# Altium project PCB_Project.PrjPcb
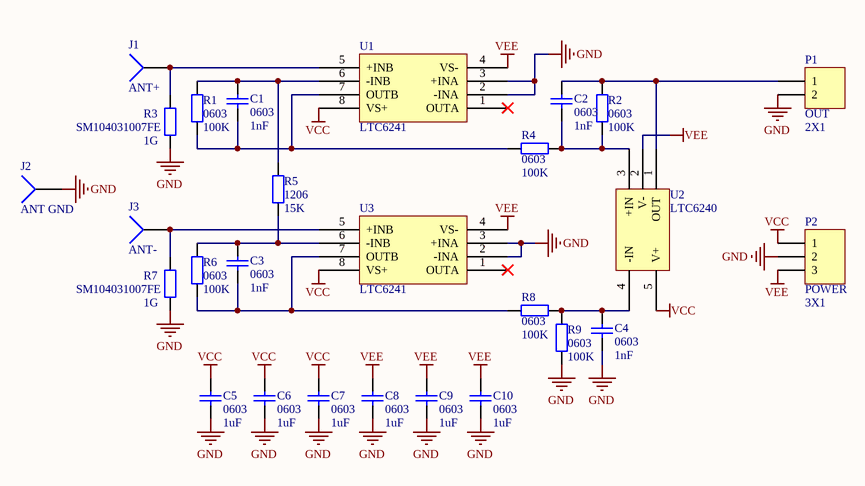
[diagram p0: Sheet1.SchDoc]
1 sheet, 27 parts. Net scope: global (net labels, ports and power ports of the same name join across sheets).
Board file: PCB1.PcbDoc

## Sheet Sheet1.SchDoc: Antenna Differential Preamplifier
size A4; ApprovedBy: Matej Gomboc; CheckedBy: Matej Gomboc; Author: Matej Gomboc; DrawnBy: Matej Gomboc; Engineer: Matej Gomboc; DocumentNumber: 1; Revision: 1.0; SheetNumber: 1; SheetTotal: 1; ProjectName: Antenna Differential Preamplifier

### Parts
C1  0603  value 1nF  [1608[0603]]
C2  0603  value 1nF  [1608[0603]]
C3  0603  value 1nF  [1608[0603]]
C4  0603  value 1nF  [1608[0603]]
C5  0603  value 1uF  [1608[0603]]
C6  0603  value 1uF  [1608[0603]]
C7  0603  value 1uF  [1608[0603]]
C8  0603  value 1uF  [1608[0603]]
C9  0603  value 1uF  [1608[0603]]
C10  0603  value 1uF  [1608[0603]]
J1  ANT+  [PIN1]
J2  ANT GND  [PIN1]
J3  ANT-  [PIN1]
P1  OUT  value 2X1  [HDR1X2]
P2  POWER  value 3X1  [HDR1X3]
R1  0603  value 100K  [1608[0603]]
R2  0603  value 100K  [1608[0603]]
R3  SM104031007FE  value 1G  [OHMITE_SM104031007FE_ThroughHoleResistor]
R4  0603  value 100K  [1608[0603]]
R5  1206  value 15K  [C1206]
R6  0603  value 100K  [1608[0603]]
R7  SM104031007FE  value 1G  [OHMITE_SM104031007FE_ThroughHoleResistor]
R8  0603  value 100K  [1608[0603]]
R9  0603  value 100K  [1608[0603]]
U1  LTC6241  [LTC6241_SOIC8]
U2  LTC6240  [LTC6240_SOT23]
U3  LTC6241  [LTC6241_SOIC8]

### Nets
GND: C4.1 C5.1 C6.1 C7.1 C8.1 C9.1 C10.1 J2.1 P1.2 P2.2 R3.1 R7.1 R9.2 U1.2(-INA) U1.3(+INA) U3.2(-INA) U3.3(+INA)
VCC: C5.2 C6.2 C7.2 P2.1 U1.8(VS+) U2.5(V+) U3.8(VS+)
VEE: C8.2 C9.2 C10.2 P2.3 U1.4(VS-) U2.2(V-) U3.4(VS-)
NetC1_1: C1.1 R1.2 R4.1 U1.7(OUTB)
NetC1_2: C1.2 R1.1 R5.2 U1.6(-INB)
NetC2_1: C2.1 P1.1 R2.2 U2.1(OUT)
NetC2_2: C2.2 R2.1 R4.2 U2.3(+IN)
NetC3_1: C3.1 R6.2 R8.1 U3.7(OUTB)
NetC3_2: C3.2 R5.1 R6.1 U3.6(-INB)
NetC4_2: C4.2 R8.2 R9.1 U2.4(-IN)
NetJ1_1: J1.1 R3.2 U1.5(+INB)
NetJ3_1: J3.1 R7.2 U3.5(+INB)

Not connected (* = marked no-connect by the designer): U1 1(OUTA)*; U3 1(OUTA)*

### Library data of the parts
C1-C10 = Cap: Capacitor
J1-J3 = Socket
P1 = Header 2: Header, 2-Pin
P2 = Header 3: Header, 3-Pin
R1-R9 = Res2: Resistor
U1 U3 = LTC6241: low noise, high input impedance opamp
U2 = LTC6240: low noise jfet opamp